# EAGLE design portal parkir (EAGLE 9.6.2)
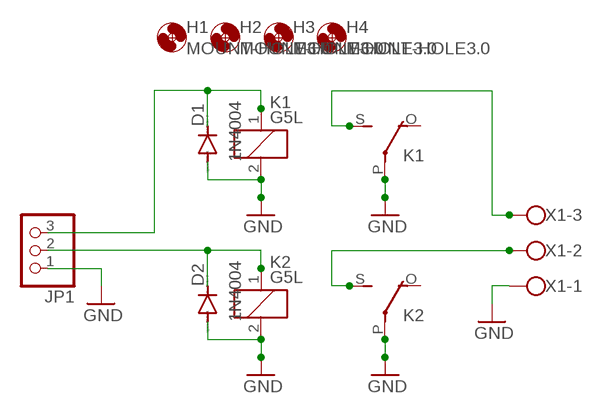
[diagram p0: schematic, sheet 1]

## Parts
D1  1N4004  [DO41-10]
D2  1N4004  [DO41-10]
H1  MOUNT-HOLE3.0  [3,0]
H2  MOUNT-HOLE3.0  [3,0]
H3  MOUNT-HOLE3.0  [3,0]
H4  MOUNT-HOLE3.0  [3,0]
JP1  PINHD-1X3  [1X03]
K1  G5L  [G5LE]
K2  G5L  [G5LE]
X1  W237-103  [W237-103]

## Nets
GND: D1.A D2.A JP1.1 K1.2 K1.P(2:P) K2.2 K2.P(2:P) X1.1
N$1: D1.C JP1.3 K1.1
N$2: D2.C JP1.2 K2.1
N$4: K2.S(2:S) X1.2
N$5: K1.S(2:S) X1.3
Unconnected: K1.O(2:O) K2.O(2:O)

## Library data of the parts
D1 D2 = diode:1N4004: DIODE general purpose rectifier, 1 A
H1-H4 = holes:MOUNT-HOLE: MOUNTING HOLE with drill center marker
JP1 = pinhead:PINHD-1X3: PIN HEADER
K1 K2 = relay:G5L: RELAY 1 x switch, 10 A/120 V AC, 8 A/30 V ADC, Omron; OC_FARNELL: unknown; OC_NEWARK: unknown
X1 = con-wago-500:W237-103: WAGO SCREW CLAMP; MPN: 237-103; OC_FARNELL: unknown; OC_NEWARK: 18M7116

## Board
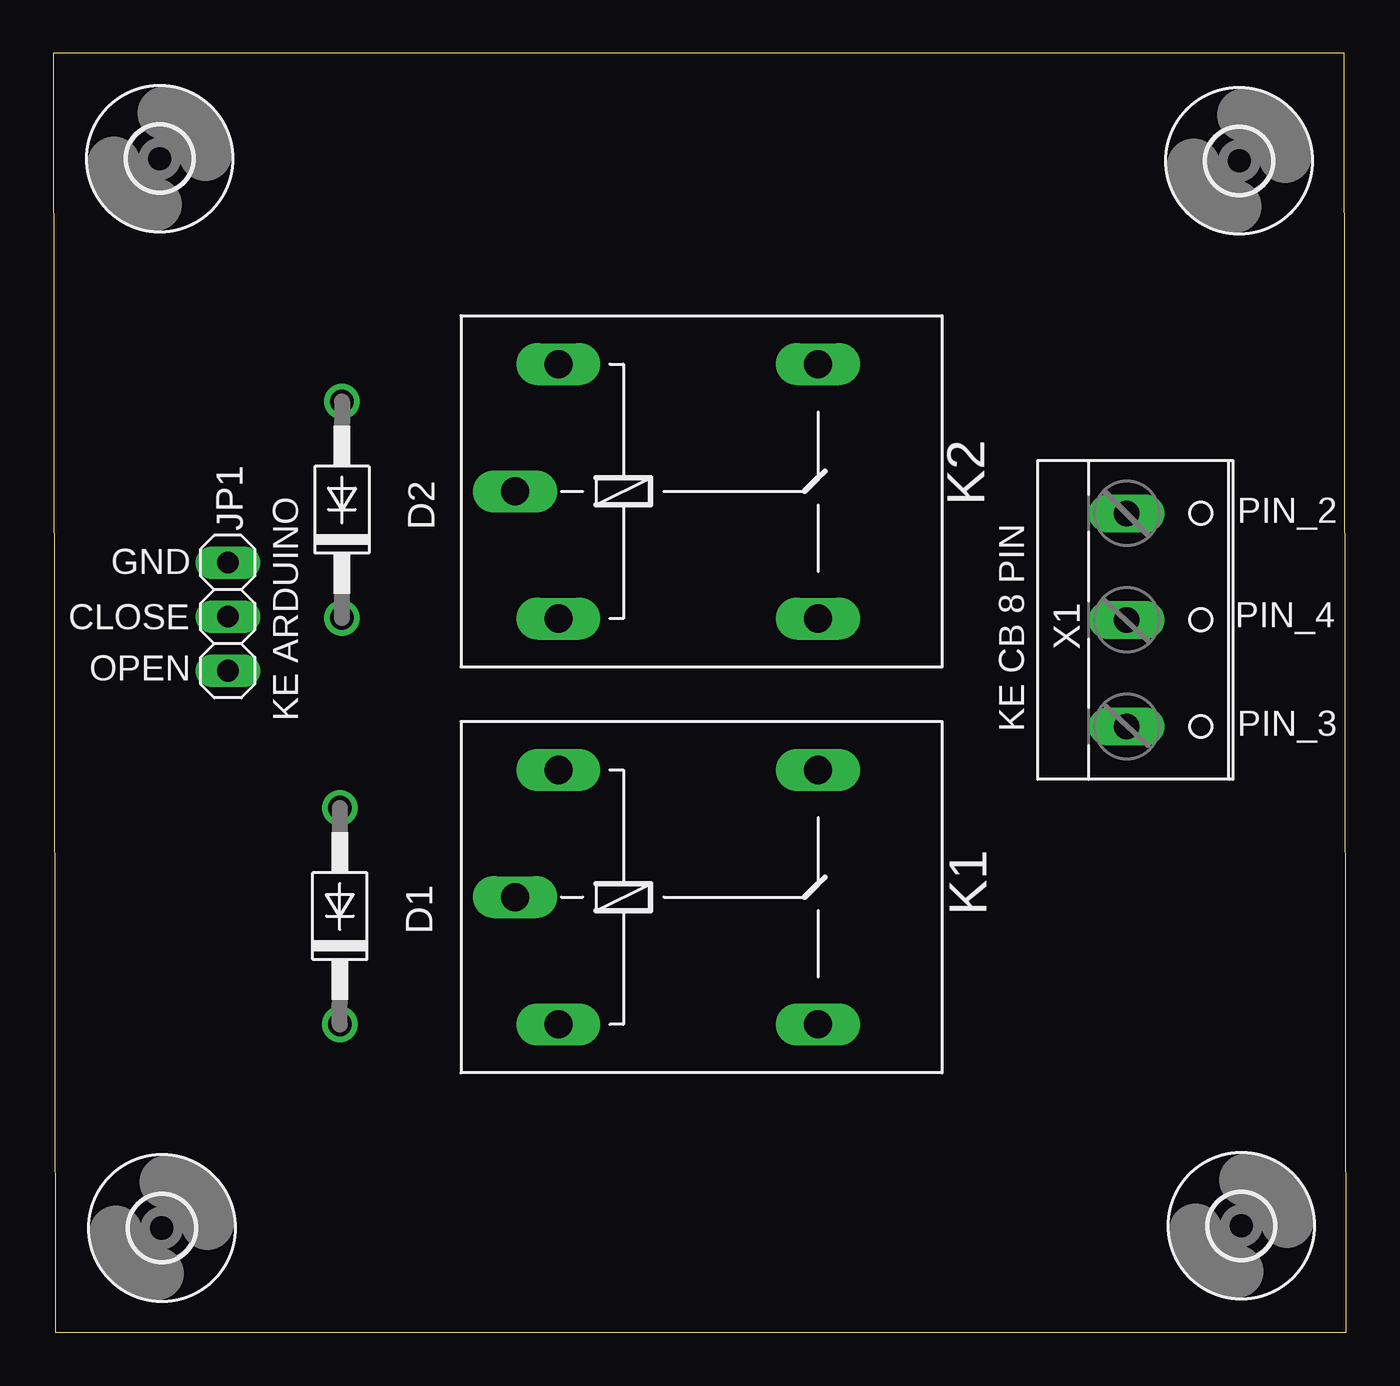
[diagram p1: board, top side]
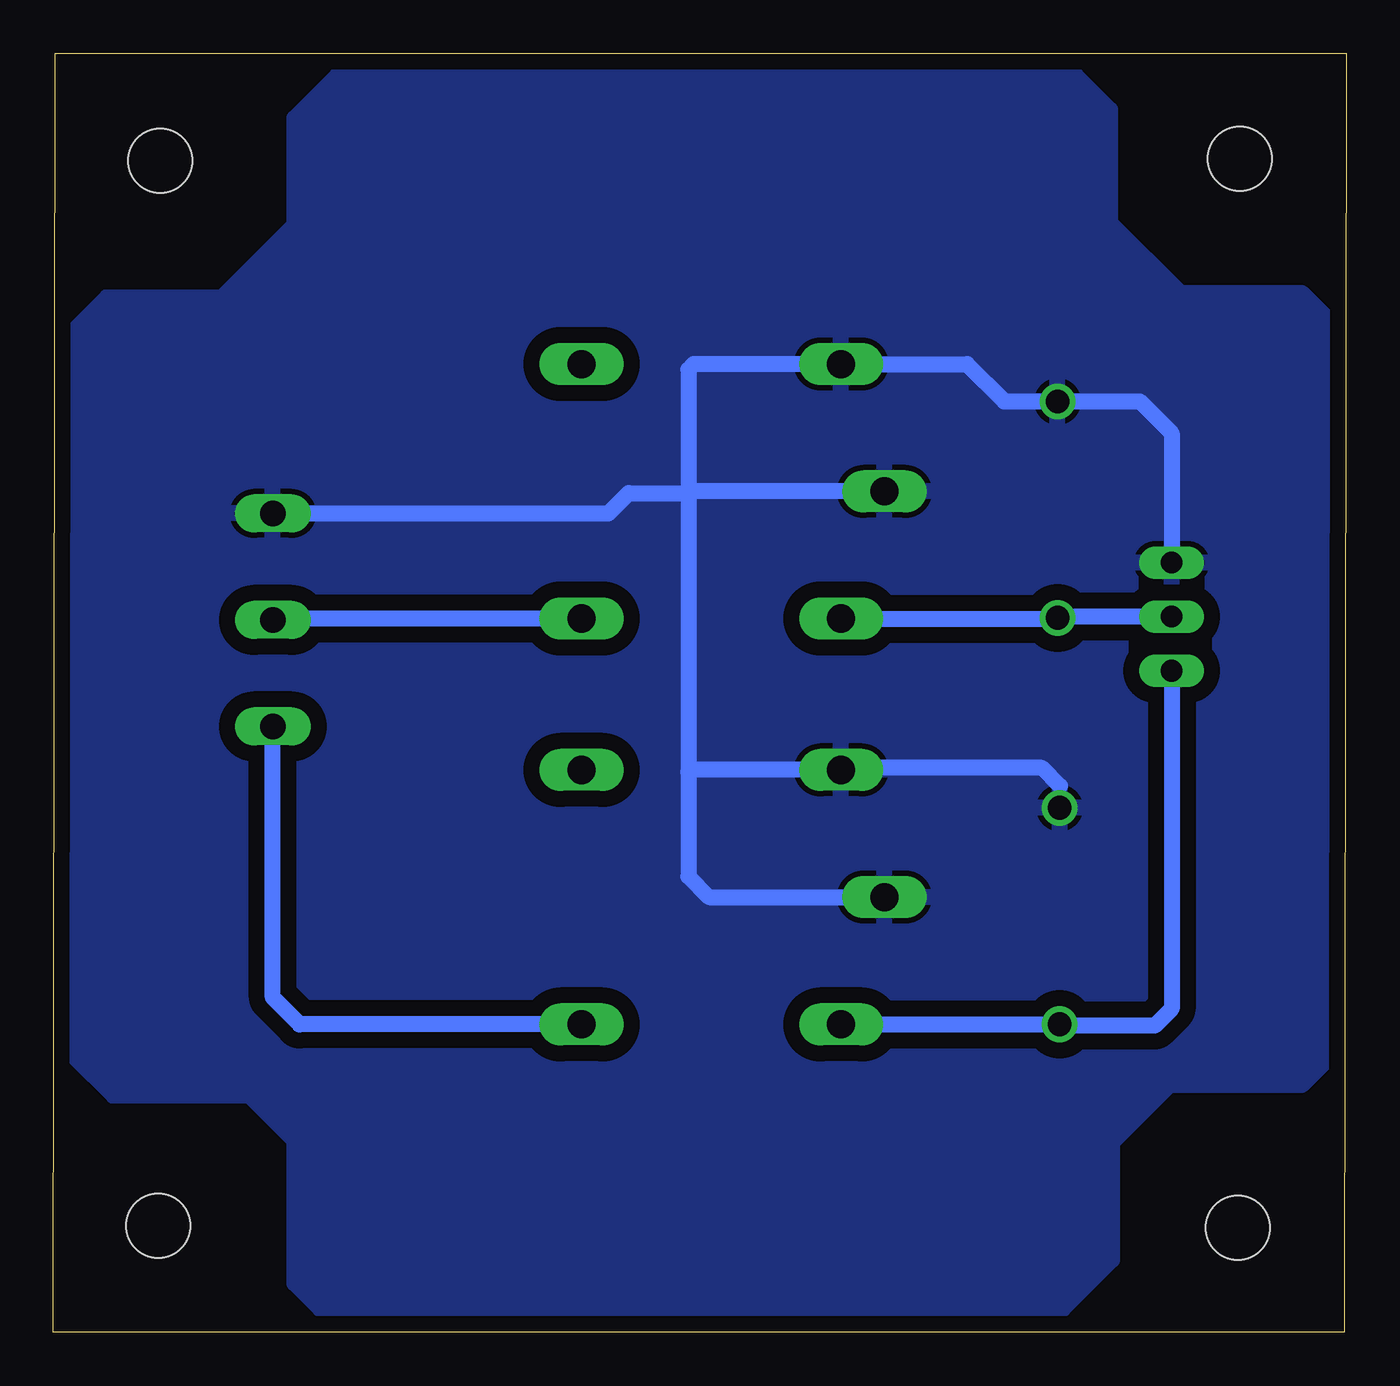
[diagram p2: board, bottom side, seen from below]

Size 60.73 x 60.05 mm. Coordinates in mm from the lower left corner, seen from the top.
Outline: 0.1,0 60.73,0 60.63,60.05 0,60.05 0.1,0
Copper layers (1*16): Top 0.035mm / dielectric 1.5mm / Bottom 0.035mm
Design rules "default": minimum track width 6mil, minimum drill 0.35mm, track to track 12mil, track to pad 12mil, pad to pad 12mil, via to via 6mil, smd to smd 12mil, copper to edge 24mil, drill to drill 6mil, minimum pad ring 10mil, minimum via ring 8mil, stop-mask expansion 4mil, vias tented up to drill 0mil, thermal gap 10mil

### Footprints (pad centres in the part's own frame; a part is rotated, then mirrored left to right if it is on the bottom)
DO41-10 = drill 1.118: A 5.08,0; C -5.08,0
3,0 = hole 3: 0,0
1X03 = drill 1.016 long: 1 -2.54,0; 2 0,0; 3 2.54,0
G5LE = drill 1.321 long: 1 -7.493,-5.969; 2 -7.493,5.969; O 4.699,5.969; P -9.525,0; S 4.699,-5.969
W237-103 = drill 1.194 long: 1 -5,-1.29; 2 0,-1.29; 3 5,-1.29

### Placement (x,y rotation side)
D1  13.46,19.54 90 top
D2  13.56,38.62 90 top
H1  5,55.1 0 top
H2  55.7,55 0 top
H3  5.1,4.9 0 top
H4  55.8,5 0 top
JP1  8.2,33.6 270 top
K1  31.22,20.43 0 top
K2  31.22,39.48 0 top
X1  51.71,33.45 270 top

### Tracks (layer width: path | path; a pad name or v marks a point on that pad's centre or on a via)
GND
  Bottom 0.75: 13.44,25.64 14.3,26.5 23.63,26.5 K1.2 30.8,26.4 30.9,26.3 | 30.9,39.4 30.9,45.2 30.65,45.45 K2.2 17.81,45.45 16.06,43.7 D2.A | 30.9,39.4 30.9,26.3 | 30.9,26.3 30.9,21.4 29.93,20.43 K1.P | K2.P 30.82,39.48 30.9,39.4 | 13.52,43.66 D2.A | X1.1 34.65,38.45 33.7,39.4 30.9,39.4 | D2.A 9.7,43.7 8.2,42.2 JP1.1
  pour Bottom (isolate 0.75): 0.9,12.8 2.1,11.6 8.3,11.6 11,8.9 11,3.4 13.3,1.1 48.2,1.1 49.4,2.3 49.4,9 51.5,11.1 57.9,11.1 59.7,12.9 59.7,47.1 58.2,48.6 52.8,48.6 49.4,52 49.4,57 47.4,59 12.7,59 11.1,57.4 11.1,52.1 7.8,48.8 2.1,48.8 0.9,47.6
N$1
  Bottom 0.75: K1.1 D1.C 13.4,14.4 9,14.4 8.2,15.2 JP1.3
N$2
  Bottom 0.75: K2.1 13.59,33.51 D2.C 13.5,33.6 JP1.2
N$4
  Bottom 0.75: K2.S 50.36,33.51 X1.2
N$5
  Bottom 0.75: K1.S 49.16,14.46 50.42,15.72 X1.3

### Text on the board
tNames: PIN_2 | GND | CLOSE | PIN_4 | OPEN | KE ARDUINO | KE CB 8 PIN | PIN_3